# EAGLE design SparkFun Soft Power Switch (EAGLE 9.6.2)
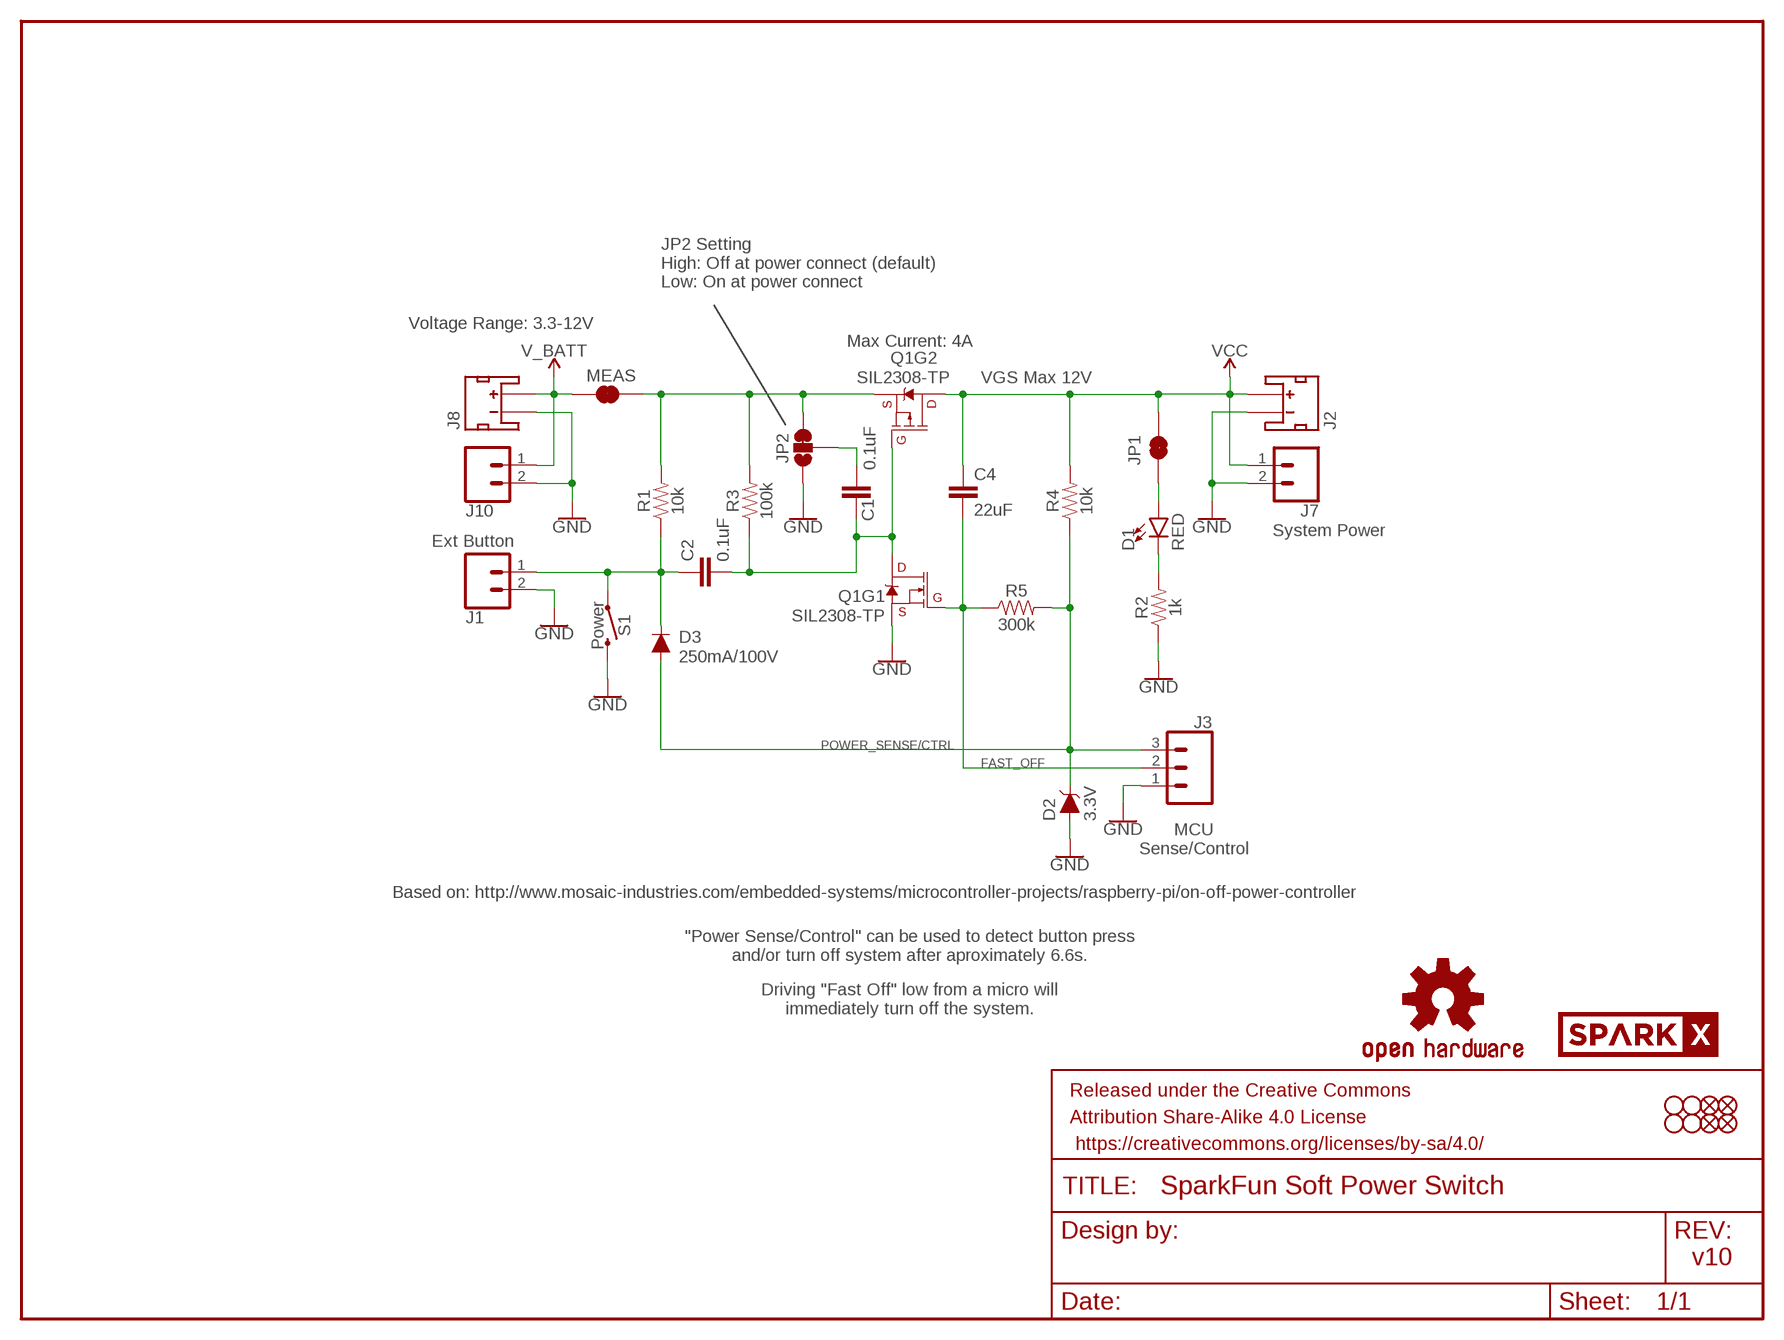
[diagram p0: schematic, sheet 1]

## Parts
C1  0.1uF  0.1UF-0603-25V-5%  [0603]
C2  0.1uF  0.1UF-0603-25V-5%  [0603]
C4  22uF  22UF-0805-16V-20%  [0805]
D1  RED  LED-RED0603  [LED-0603]
D2  3.3V  DIODE-ZENER-MM3Z3V3T1G  [SOD-323]
D3  250mA/100V  DIODE-BAS16J  [SOD-323]
FD1  FIDUCIAL1X2  [FIDUCIAL-1X2]
FD2  FIDUCIAL1X2  [FIDUCIAL-1X2]
FD3  FIDUCIAL1X2  [FIDUCIAL-1X2]
FD4  FIDUCIAL1X2  [FIDUCIAL-1X2]
FRAME1  FRAME-LETTER  [CREATIVE_COMMONS]
H1  STAND-OFF  [STAND-OFF]
H2  STAND-OFF  [STAND-OFF]
H3  STAND-OFF  [STAND-OFF]
H4  STAND-OFF  [STAND-OFF]
J1  Ext Button  CONN_021X02_NO_SILK  [1X02_NO_SILK]
J2  JST_2MM_MALE  [JST-2-SMD]
J3  CONN_031X03_NO_SILK  [1X03_NO_SILK]
J7  System Power  CONN_021X02_NO_SILK  [1X02_NO_SILK]
J8  JST_2MM_MALE  [JST-2-SMD]
J10  CONN_021X02_NO_SILK  [1X02_NO_SILK]
JP1  JUMPER-SMT_2_NC_TRACE_SILK  [SMT-JUMPER_2_NC_TRACE_SILK]
JP2  JUMPER-SMT_3_1-NC_TRACE_SILK  [SMT-JUMPER_3_1-NC_TRACE_SILK]
LOGO1  OSHW-LOGOS  [OSHW-LOGO-S]
MEAS  JUMPER-COMBO_2_NC_TRACE  [COMBO-JUMPER_2_NC_TRACE]
Q1  SIL2308-TP  MOSFET_COMPLIMENTARY_PAIR-SIL2308  [SOT26]
R1  10k  10KOHM-0603-1/10W-1%  [0603]
R2  1k  1KOHM-0603-1/10W-1%  [0603]
R3  100k  100KOHM-0603-1/10W-1%  [0603]
R4  10k  10KOHM-0603-1/10W-1%  [0603]
R5  300k  300KOHM-0603-1/10W-1%  [0603]
S1  Power  MOMENTARY-SWITCH-SPST-SMD-5.2MM-TALL  [TACTILE_SWITCH_SMD_5.2MM]
U$1  SPARKX-LOGO3  [SPARKX-SMALL]
U$15  SPARKX-LOGO2  [SPARKX-TINY]

## Nets
FAST_OFF: C4.2 J3.2 Q1.G1(G) R5.1
GND [power]: D2.A J1.2 J2.1(-) J3.1 J7.2 J8.1(-) J10.2 JP2.1 Q1.S1(S) R2.1 S1.3
N$1: C1.2 JP2.2
N$2: D1.A JP1.1
N$6: D1.C R2.2
N$15: C1.1 C2.2 Q1.D1(D) Q1.G2(G) R3.1
POWER_BTN: C2.1 D3.C J1.1 R1.1 S1.1
POWER_SENSE/CTRL: D2.C D3.A J3.3 R4.1 R5.2
V_BATT [power]: J8.2(+) J10.1 MEAS.1 MEAS.3
V_IN [power]: JP2.3 MEAS.2 MEAS.4 Q1.S2(S) R1.2 R3.2
VCC: C4.1 J2.2(+) J7.1 JP1.2 Q1.D2(D) R4.2
Unconnected: J2.NC1(PAD1) J2.NC2(PAD2) J8.NC1(PAD1) J8.NC2(PAD2)

## Notes on the sheet
- JP2 Setting
  High: Off at power connect (default)
  Low: On at power connect
- Voltage Range: 3.3-12V
- Max Current: 4A
- VGS Max 12V
- MCU
  Sense/Control
- Based on: http://www.mosaic-industries.com/embedded-systems/microcontroller-projects/raspberry-pi/on-off-power-controller
- "Power Sense/Control" can be used to detect button press
  and/or turn off system after aproximately 6.6s.
- Driving "Fast Off" low from a micro will
  immediately turn off the system.
- v10

## Library data of the parts
C1 C2 = SparkFun-Capacitors:0.1UF: 0.1µF ceramic capacitors A capacitor is a passive two-terminal electrical component used to store electrical energy temporarily in an electric field.; PROD_ID: CAP-08604
C4 = SparkFun-Capacitors:22UF: 22µF ceramic capacitors A capacitor is a passive two-terminal electrical component used to store electrical energy temporarily in an electric field.; PROD_ID: CAP-14260
D1 = SparkFun-LED:LED-RED: Red SMD LED Used in manufacturing of most products at SparkFun Packages: 0603 - SMD 0603 package [Product Link] <http://docs.avagotech.com/docs/AV02-0551EN> 0603 SMART - SMD 0603 SMART package ( more efficient and expensive)[Product Link] <http://www.osram-os.com/Graphics/XPic2/00077099_0.pdf> 1206 - SMD1206 package [Product Link] <https://www.sparkfun.com/datasheets/DevTools/LilyPad/Q150OVS4.pdff> SparkFun Products: Pro Mini 328 -5V <https://www.sparkfun.com/products/821> RedBoard <https://www.sparkfun.com/products/12757> IOIO-OTG <https://www.sparkfun.com/products/13613>; PROD_ID: DIO-00819
D2 = SparkFun-DiscreteSemi:DIODE-ZENER: Zener Diode A Zener diode allows current to flow from its anode to its cathode like a normal semiconductor diode, but it also permits current to flow in the reverse direction when its "Zener voltage" is reached. - WIkipedia; PROD_ID: DIO-11284
D3 = SparkFun-DiscreteSemi:DIODE: Diode These are standard reverse protection diodes and small signal diodes. SparkFun Products: SparkFun SparkPunk Sound Kit <https://www.sparkfun.com/products/11177> SparkFun ESP8266 Thing <https://www.sparkfun.com/products/13231>; PROD_ID: DIO-09646
FD1-FD4 = SparkFun-Aesthetics:FIDUCIAL: Fiducial Alignment Points Point-of-reference for pick-and-place machines and other optical instruments.
FRAME1 = SparkFun-Aesthetics:FRAME-LETTER: Schematic Frame - Letter Standard 8.5x11 US Letter frame
H1-H4 = SparkFun-Hardware:STAND-OFF: Stand Off Drill holes for mechanically mounting via screws, standoffs, etc. Note: Use the keepout ring to avoid running the screw head into surrounding components. Variant Overviews STAND-OFF - Mechanical footprint for a #4 phillips button head screw. STAND-OFF-TIGHT - Mechanical footprint for a #4 phillips button head screw, Example SparkFun Products Screw - Phillips Head (1/4", 4-40, 10 pack) <https://www.sparkfun.com/products/10453> (PRT-10453) Screw - Phillips Head (1/2", 4-40, 10 pack) <https://www.sparkfun.com/products/10452> (PRT-10452) Screw - Phillips Head (3/4", 4-40, 10 pack) <https://www.sparkfun.com/products/10451> (PRT-10451) Screw - Phillips Head (1", 4-40, 10 pack) <https://www.sparkfun.com/products/10450> (PRT-10450)
J1 J7 J10 = SparkFun-Connectors:CONN_02: Multi connection point. Often used as Generic Header-pin footprint for 0.1 inch spaced/style header connections On any of the 0.1 inch spaced packages, you can populate with these: Break Away Headers - Straight <https://www.sparkfun.com/products/116> (PRT-00116) Break Away Male Headers - Right Angle <https://www.sparkfun.com/products/553> (PRT-00553) Female Headers <https://www.sparkfun.com/products/115> (PRT-00115) Break Away Headers - Machine Pin <https://www.sparkfun.com/products/117> (PRT-00117) Break Away Female Headers - Swiss Machine Pin <https://www.sparkfun.com/products/743> (PRT-00743) For SCREWTERMINALS and SPRING TERMINALS visit here: Screw Terimnals on SparkFun.com <https://www.sparkfun.com/search/results?term=Screw+Terminals> (5mm/3.5mm/2.54mm spacing) This device is also useful as a general connection point to wire up your design to another part of your project. Our various solder wires solder well into these plated through hole pads. Hook-Up Wire - Assortment (Stranded, 22 AWG) <https://www.sparkfun.com/products/11375> (PRT-11375) Hook-Up Wire - Assortment (Solid Core, 22 AWG) <https://www.sparkfun.com/products/11367> (PRT-11367) View the entire wire category on our website here <https://www.sparkfun.com/categories/141> Special notes: Molex polarized connector foot print use with: PRT-08233 with associated crimp pins and housings. 2.54_SCREWTERM for use with PRT-10571. 3.5mm Screw Terminal footprints for PRT-08084 5mm Screw Terminal footprints for use with PRT-08432
J2 J8 = SparkFun-Connectors:JST_2MM_MALE: JST 2MM MALE RA CONNECTOR Two pin, compact surface mount connector. Commonly used as a battery input connection point. We really like the solid locking feeling and high current rating on these small connectors. We use these all the time as battery connectors. Mates to single-cell LiPo batteries. Here is the connector we sell at SparkFun: JST Right Angle Connector - White <https://www.sparkfun.com/products/8612> (PRT-08612) Datasheet <http://www.sparkfun.com/datasheets/Prototyping/Connectors/JST-Horizontal.pdf> It was used on these SparkFun products: SparkFun MOSFET Power Controller <https://www.sparkfun.com/products/11214> (PRT-11214) SparkFun Battery Babysitter - LiPo Battery Manager <https://www.sparkfun.com/products/13777> (PRT-13777) And many, many others that required a lipo battery connection.; PROD_ID: CONN-11443; SF_ID: PRT-08612
J3 = SparkFun-Connectors:CONN_03: Multi connection point. Often used as Generic Header-pin footprint for 0.1 inch spaced/style header connections On any of the 0.1 inch spaced packages, you can populate with these: Break Away Headers - Straight <https://www.sparkfun.com/products/116> (PRT-00116) Break Away Male Headers - Right Angle <https://www.sparkfun.com/products/553> (PRT-00553) Female Headers <https://www.sparkfun.com/products/115> (PRT-00115) Break Away Headers - Machine Pin <https://www.sparkfun.com/products/117> (PRT-00117) Break Away Female Headers - Swiss Machine Pin <https://www.sparkfun.com/products/743> (PRT-00743) Stackable Header - 3 Pin (Female, 0.1") <https://www.sparkfun.com/products/13875> (PRT-13875) For SCREWTERMINALS and SPRING TERMINALS visit here: Screw Terimnals on SparkFun.com <https://www.sparkfun.com/search/results?term=Screw+Terminals> (5mm/3.5mm/2.54mm spacing) This device is also useful as a general connection point to wire up your design to another part of your project. Our various solder wires solder well into these plated through hole pads. Hook-Up Wire - Assortment (Stranded, 22 AWG) <https://www.sparkfun.com/products/11375> (PRT-11375) Hook-Up Wire - Assortment (Solid Core, 22 AWG) <https://www.sparkfun.com/products/11367> (PRT-11367) View the entire wire category on our website here <https://www.sparkfun.com/categories/141> Special notes: Molex polarized connector foot print use with SKU : PRT-08232 with associated crimp pins and housings.
JP1 = SparkFun-Jumpers:JUMPER-SMT_2_NC_TRACE: Normally closed trace jumper This jumper has a trace between two pads so it's normally closed (NC). Use a razor knife to open the connection. For best results follow the IPC guidelines for cutting traces: Cutout at least 0.063 mm (0.005 in). Remove all loose material to clean up the cut area. Seal the cut with an approved epoxy. Reapply solder to reclose the connection.
JP2 = SparkFun-Jumpers:JUMPER-SMT_3_1-NC_TRACE: Normally closed trace jumper (1 of 2 connections) This jumper has a trace between two pads so it's normally closed (NC). The other connection is normally open (NO). Use a razor knife to open the connection. For best results follow the IPC guidelines for cutting traces: Cutout at least 0.063 mm (0.005 in). Remove all loose material to clean up the cut area. Seal the cut with an approved epoxy. Reapply solder to reclose the connection, or to close the NO connection.
LOGO1 = SparkFun-Aesthetics:OSHW-LOGO: Open-Source Hardware (OSHW) Logo This logo indicates the piece of hardware it is found on incorporates a OSHW license and/or adheres to the definition of open source hardware found here: http://freedomdefined.org/OSHW
MEAS = SparkFun-Jumpers:JUMPER-COMBO_2_NC_TRACE
Q1 = SparkFun-DiscreteSemi:MOSFET_COMPLIMENTARY_PAIR: Complementary pair enhancement mode MOSFET 1A and 4A A P and N channel MOSFET in a single package. Rated to breakdown at 20V. DMC2700 is 1A. SIL2308 is 4A. Link to datasheet <http://www.diodes.com/_files/datasheets/DMC2700UDM.pdf> SparkFun Products: ZX Distance and Gesture Sensor <https://www.sparkfun.com/products/12780>; PROD_ID: TRANS-15717
R1 R4 = SparkFun-Resistors:10KOHM: 10kΩ resistor A resistor is a passive two-terminal electrical component that implements electrical resistance as a circuit element. Resistors act to reduce current flow, and, at the same time, act to lower voltage levels within circuits. - Wikipedia; PROD_ID: RES-00824
R2 = SparkFun-Resistors:1KOHM: 1kΩ resistor A resistor is a passive two-terminal electrical component that implements electrical resistance as a circuit element. Resistors act to reduce current flow, and, at the same time, act to lower voltage levels within circuits. - Wikipedia; PROD_ID: RES-07856
R3 = SparkFun-Resistors:100KOHM: 100kΩ resistor A resistor is a passive two-terminal electrical component that implements electrical resistance as a circuit element. Resistors act to reduce current flow, and, at the same time, act to lower voltage levels within circuits. - Wikipedia; PROD_ID: RES-07828
R5 = SparkFun-Resistors:300KOHM: 300kΩ resistor A resistor is a passive two-terminal electrical component that implements electrical resistance as a circuit element. Resistors act to reduce current flow, and, at the same time, act to lower voltage levels within circuits. - Wikipedia; PROD_ID: RES-10809
S1 = SparkFun-Switches:MOMENTARY-SWITCH-SPST: Momentary Switch (Pushbutton) - SPST Normally-open (NO) SPST momentary switches (buttons, pushbuttons). Variants PTH-12MM - 12mm square, through-hole Momentary Pushbutton Switch - 12mm Square <https://www.sparkfun.com/products/9190> (COM-09190) PTH-6.0MM, PTH-6.0MM-KIT - 6.0mm square, through-hole Mini Pushbutton Switch <https://www.sparkfun.com/products/97> (COM-00097) KIT package intended for soldering kit's - only one side of pads' copper is exposed. PTH-RIGHT-ANGLE-KIT - Right-angle, through-hole Right Angle Tactile Button <https://www.sparkfun.com/products/10791> - Used on SparkFun BigTime Watch Kit <https://www.sparkfun.com/products/11734> SMD-12MM - 12mm square, surface-mount Tactile Button - SMD (12mm) <https://www.sparkfun.com/products/12993> (COM-12993) Used on SparkFun PicoBoard <https://www.sparkfun.com/products/11888> SMD-4.5MM - 4.5mm Square Trackball Switch Used on SparkFun Blackberry Trackballer Breakout <https://www.sparkfun.com/products/13169> SMD-4.6MMX2.8MM - 4.60mm x 2.80mm, surface mount Used on SparkFun SAMD21 Mini Breakout <https://www.sparkfun.com/products/13664> SMD-5.2MM, SMD-5.2-REDUNDANT - 5.2mm square, surface-mount Mini Pushbutton Switch - SMD <https://www.sparkfun.com/products/8720> (COM-08720) Used on Arduino Pro Mini <https://www.sparkfun.com/products/11114> REDUNDANT package connects both switch circuits together SMD-6.0X3.5MM - 6.0 x 3.5mm, surface mount Momentary Reset Switch SMD <https://www.sparkfun.com/products/8229> (COM-08229) SMD-6.2MM-TALL - 6.2mm square, surface mount Tactile Button - SMD (6mm) <https://www.sparkfun.com/products/12992> Used on SparkFun Digital Sandbox <https://www.sparkfun.com/products/12651> SMD-RIGHT-ANGLE - Right-angle, surface mount Used on SparkFun Block for Intel® Edison - Arduino <https://www.sparkfun.com/products/13036>; PROD_ID: SWCH-14139
U$1 U$15 = SparkX:SPARKX-LOGO

## Net classes
1 power: width 0.305 mm

## Board
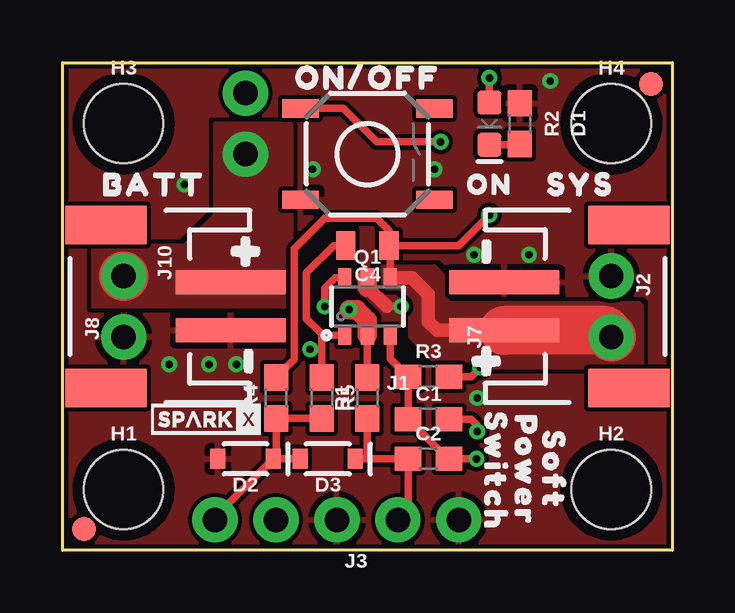
[diagram p1: board, top side]
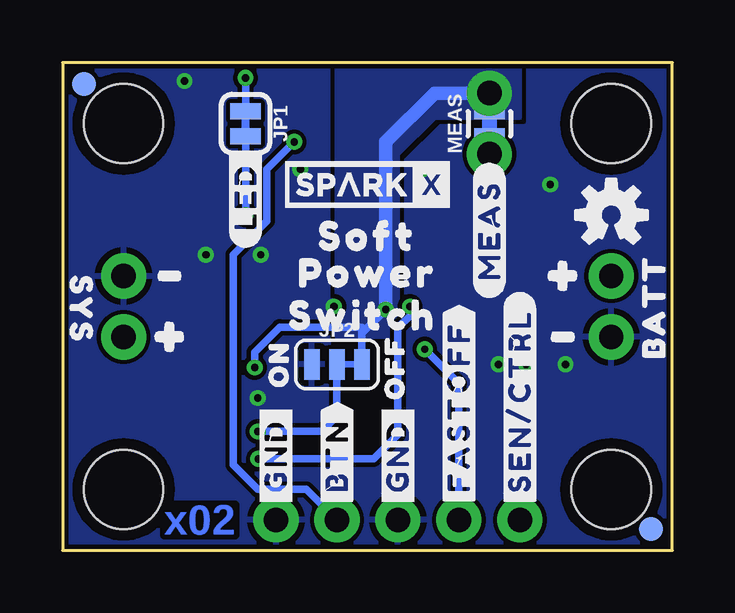
[diagram p2: board, bottom side, seen from below]

Size 25.4 x 20.32 mm. Coordinates in mm from the lower left corner, seen from the top.
Outline: 0,0 0,20.32 25.4,20.32 25.4,0 0,0
Copper layers (1*16): Top 0.035mm / dielectric 1.5mm / Bottom 0.035mm
Design rules "SparkFun-2-Layer-General-JLCPCB": minimum track width 7mil, minimum drill 0.3mm, track to track 7mil, track to pad 7mil, pad to pad 7mil, via to via 7mil, smd to smd 7mil, copper to edge 7mil, drill to drill 7mil, minimum pad ring 7mil, minimum via ring 7mil, stop-mask expansion 4mil, vias tented up to drill 25mil, thermal gap 10mil

### Footprints (pad centres in the part's own frame; a part is rotated, then mirrored left to right if it is on the bottom)
0603 = smd 1.1 x 1: 1 -0.85,0; 2 0.85,0
0805 = smd 0.8 x 1.2: 1 -0.9,0; 2 0.9,0
LED-0603 = smd 1 x 1: A -0.877,0; C 0.877,0
SOD-323 = smd 0.63 x 0.83: A 1.15,0; C -1.15,0
FIDUCIAL-1X2 = smd 1 x 1: 1 0,0
STAND-OFF = hole 3.302: 0,0
1X02_NO_SILK = drill 1.016 pad 1.88: 1 0,0; 2 2.54,0
JST-2-SMD = smd 1 x 4.6: 1 -1,-3.7; 2 1,-3.7 | smd 1.6 x 3.4: NC1 -3.4,1.5; NC2 3.4,1.5
1X03_NO_SILK = drill 1.016 pad 1.88: 1 0,0; 2 2.54,0; 3 5.08,0
SMT-JUMPER_2_NC_TRACE_SILK = smd 0.66 x 1.27: 1 -0.521,0; 2 0.521,0
SMT-JUMPER_3_1-NC_TRACE_SILK = smd 0.66 x 1.27: 1 -1.041,0; 2 0,0; 3 1.041,0
COMBO-JUMPER_2_NC_TRACE = smd 0.635 x 1.27: 1 -0.508,0; 2 0.508,0 | drill 1.016 pad 1.88: 3 -1.27,0; 4 1.27,0
SOT26 = smd 0.55 x 0.8: D1 -0.95,1.2; D2 0.95,1.2; G1 -0.95,-1.2; G2 0.95,-1.2; S1 0,1.2; S2 0,-1.2
TACTILE_SWITCH_SMD_5.2MM = smd 1.524 x 0.762: 1 -2.794,1.905; 2 2.794,1.905; 3 -2.794,-1.905; 4 2.794,-1.905

### Placement (x,y rotation side)
C1  15.24,5.46 0 top
C2  15.24,3.81 0 top
C4  12.7,12.7 180 top
D1  17.78,17.78 270 top
D2  7.62,3.81 180 top
D3  11.05,3.81 180 top
FD1  24.51,19.43 0 top
FD2  0.89,0.89 0 bottom
FD3  24.51,19.43 0 bottom
FD4  0.89,0.89 0 top
FRAME1  -16.51,-13.97 0 top  (outside the outline)
H1  2.54,2.54 0 top
H2  22.86,2.54 0 top
H3  2.54,17.78 0 top
H4  22.86,17.78 0 top
J1  13.97,1.27 0 top
J2  22.1,10.16 270 top
J3  11.43,1.27 180 top
J7  22.86,8.89 90 top
J8  3.3,10.16 90 top
J10  2.54,11.43 270 top
JP1  17.78,17.78 270 bottom
JP2  13.97,7.75 0 bottom
LOGO1  2.54,13.97 0 bottom
MEAS  7.62,17.78 90 bottom
Q1  12.7,10.16 0 top
R1  12.7,6.35 90 top
R2  19.05,17.78 270 top
R3  15.24,7.24 0 top
R4  8.89,6.35 90 top
R5  10.79,6.35 270 top
S1  12.7,16.51 0 top
U$1  12.7,15.24 0 bottom
U$2  [#BTN#2]  13.97,3.94 90 bottom
U$3  [#GND#0]  16.51,3.94 90 bottom
U$4  [#GND#0]  11.43,3.94 90 bottom
U$5  [#SEN#CTRL#1]  6.35,6.22 90 bottom
U$6  [ON#OFF0]  12.7,19.68 0 top
U$7  [BATT0]  3.81,15.24 0 top
U$8  [SYS1]  21.59,15.24 0 top
U$9  [#0]  7.75,12.45 0 top
U$10  [#0]  17.78,7.87 0 top
U$11  [#1]  17.65,12.32 270 top
U$12  [#1]  7.75,7.75 270 top
U$13  [#MEAS#0]  7.62,13.34 90 bottom
U$14  [#0]  4.45,11.43 0 bottom
U$15  5.97,5.46 0 top
U$16  [OFF1]  11.56,7.62 90 bottom
U$17  [SWITCH2]  18.03,3.3 270 top
U$18  [ON0]  17.78,15.24 0 top
U$19  [#LED#0]  17.78,14.73 90 bottom
U$20  [#1]  4.7,8.89 180 bottom
U$21  [SOFT_0]  20.45,3.17 270 top
U$22  [#0]  20.83,8.89 0 bottom
U$23  [#1]  21.08,11.43 180 bottom
U$24  [POWER_1]  19.3,3.17 270 top
U$25  [ON0]  16.38,7.75 90 bottom
U$26  [#FASTOFF#0]  8.89,5.97 90 bottom
U$27  [SOFT0]  12.7,13.08 0 bottom
U$28  [POWER1]  12.7,11.56 0 bottom
U$29  [BATT0]  0.76,10.16 90 bottom
U$30  [SWITCH_2]  12.7,9.78 0 bottom
U$31  [SYS1]  24.64,10.03 270 bottom

### Tracks (layer width: path | path; a pad name or v marks a point on that pad's centre or on a via)
FAST_OFF  (via drill 0.3)
  Top 0.305: R5.1 10.79,8.38 | 10.79,8.38 10.79,8.89 | 10.79,8.89 10.79,9.02 10.16,9.65 10.16,11.56 11.3,12.7 C4.2 | Q1.G1 10.87,8.96 10.79,8.89 | v10.31,8.38 10.79,8.38
  Bottom 0.305: v10.31,8.38 8.89,6.96 J3.2
GND  (via drill 0.3)
  Top 0.305: v14.1,10.16 13.51,10.16
  Top 0.559: 13.51,10.16 12.7,10.97
  Top 0.813: 12.7,10.97 Q1.S1
  other vias: 10.41,15.88 15.49,15.88 5.08,15.24 17.27,6.35 19.43,12.32 17.14,12.32 7.24,7.75 6.1,7.75 4.45,7.75 20.32,19.56
  pour Top (isolate 0.178, rank 3): 0,20.32 25.4,20.32 25.4,0 0,0
  pour Bottom (isolate 0.178, rank 3): 0,20.32 25.4,20.32 25.4,0 0,0
N$1  (via drill 0.3)
  Top 0.305: v17.27,4.95 17.27,5.21 17.02,5.46 C1.2
  Bottom 0.305: JP2.2 13.97,5.59 14.61,4.95 v17.27,4.95
N$2  (via drill 0.3)
  Top 0.305: D1.A v17.78,19.68
  Bottom 0.305: JP1.1 v17.78,19.68
N$6
  Top 0.305: R2.2 19.02,16.9 D1.C
N$15  (via drill 0.3)
  Top 0.305: v10.92,10.16 10.92,10.92 11.36,11.36 Q1.D1 | Q1.G2 13.65,7.98 R3.1 C1.1 16.04,3.81 C2.2 v17.25,3.81
  Bottom 0.305: v17.25,3.81 12.45,3.81 11.43,4.83 11.43,9.27 10.92,9.78 v10.92,10.16
POWER_BTN  (via drill 0.3)
  Top 0.305: S1.1 11.68,18.41 13.08,17.02 v15.75,17.02 | D3.C 12.7,3.81 | 12.7,3.81 C2.1 14.39,1.69 J1.1 | R1.1 12.7,3.81
  Bottom 0.305: v15.75,17.02 16.89,15.88 16.89,13.72 18.29,12.32 18.29,3.56 17.27,2.54 15.24,2.54 J1.1
POWER_SENSE/CTRL
  Top 0.305: R5.2 R4.1 8.89,3.93 | 8.89,3.93 D2.C 6.35,1.39 J3.3 | D3.A 9.01,3.81 8.89,3.93
V_BATT
  Top 2.032: 2.56,11.41 J10.1
  Bottom 0.305: MEAS.1 MEAS.3
  pour Top (isolate 0.178, no thermals): 1.27,12.7 5.08,12.7 6.35,13.97 6.35,17.78 9.53,17.78 9.53,10.16 1.27,10.16
V_IN  (via drill 0.3)
  Top 0.305: Q1.S2 R1.2 | v17.4,7.62 17.02,7.24 R3.2
  Top 0.813: Q1.S2 12.7,9.6 12.26,10.03 v11.94,10.03
  Bottom 0.305: MEAS.2 MEAS.4 | 12.93,7.62 JP2.3 12.93,9.04 | 12.93,9.04 12.93,9.3 16.36,9.3 17.4,8.26 v17.4,7.62 | 12.93,9.04 v11.94,10.03
  Bottom 0.559: v11.94,10.03 11.94,17.02 9.91,19.05 MEAS.4
  pour Bottom (isolate 0.178, no thermals): 6.35,20.32 13.97,20.32 13.97,8.89 11.43,8.89 11.43,16.51 9.91,18.03 6.35,18.03
VCC  (via drill 0.3)
  Top 0.305: v17.78,13.97 16.51,12.7 C4.1 | C4.1 | R4.2 9.65,7.96 9.65,12.57 10.92,13.84 13.08,13.84 13.6,13.32 C4.1 | C4.1 13.65,12.65 Q1.D2
  Top 0.559: J2.2 15.61,9.16 15.24,9.53 15.24,10.67 14.55,11.36 Q1.D2
  Top 2.032: J2.2 22.59,9.16 J7.1
  Bottom 0.305: JP1.2 v17.78,13.97
  pour Top (isolate 0.178, no thermals): 13.34,11.81 15.49,11.81 15.88,11.43 15.88,10.54 16.13,10.29 24,10.29 24.13,10.16 24.13,7.62 15.75,7.62 14.48,8.89 14.48,10.54 14.1,10.92 13.34,10.92

### Text on the board
Bottom: x02